# EAGLE design fakealarm (EAGLE 7.1.0)
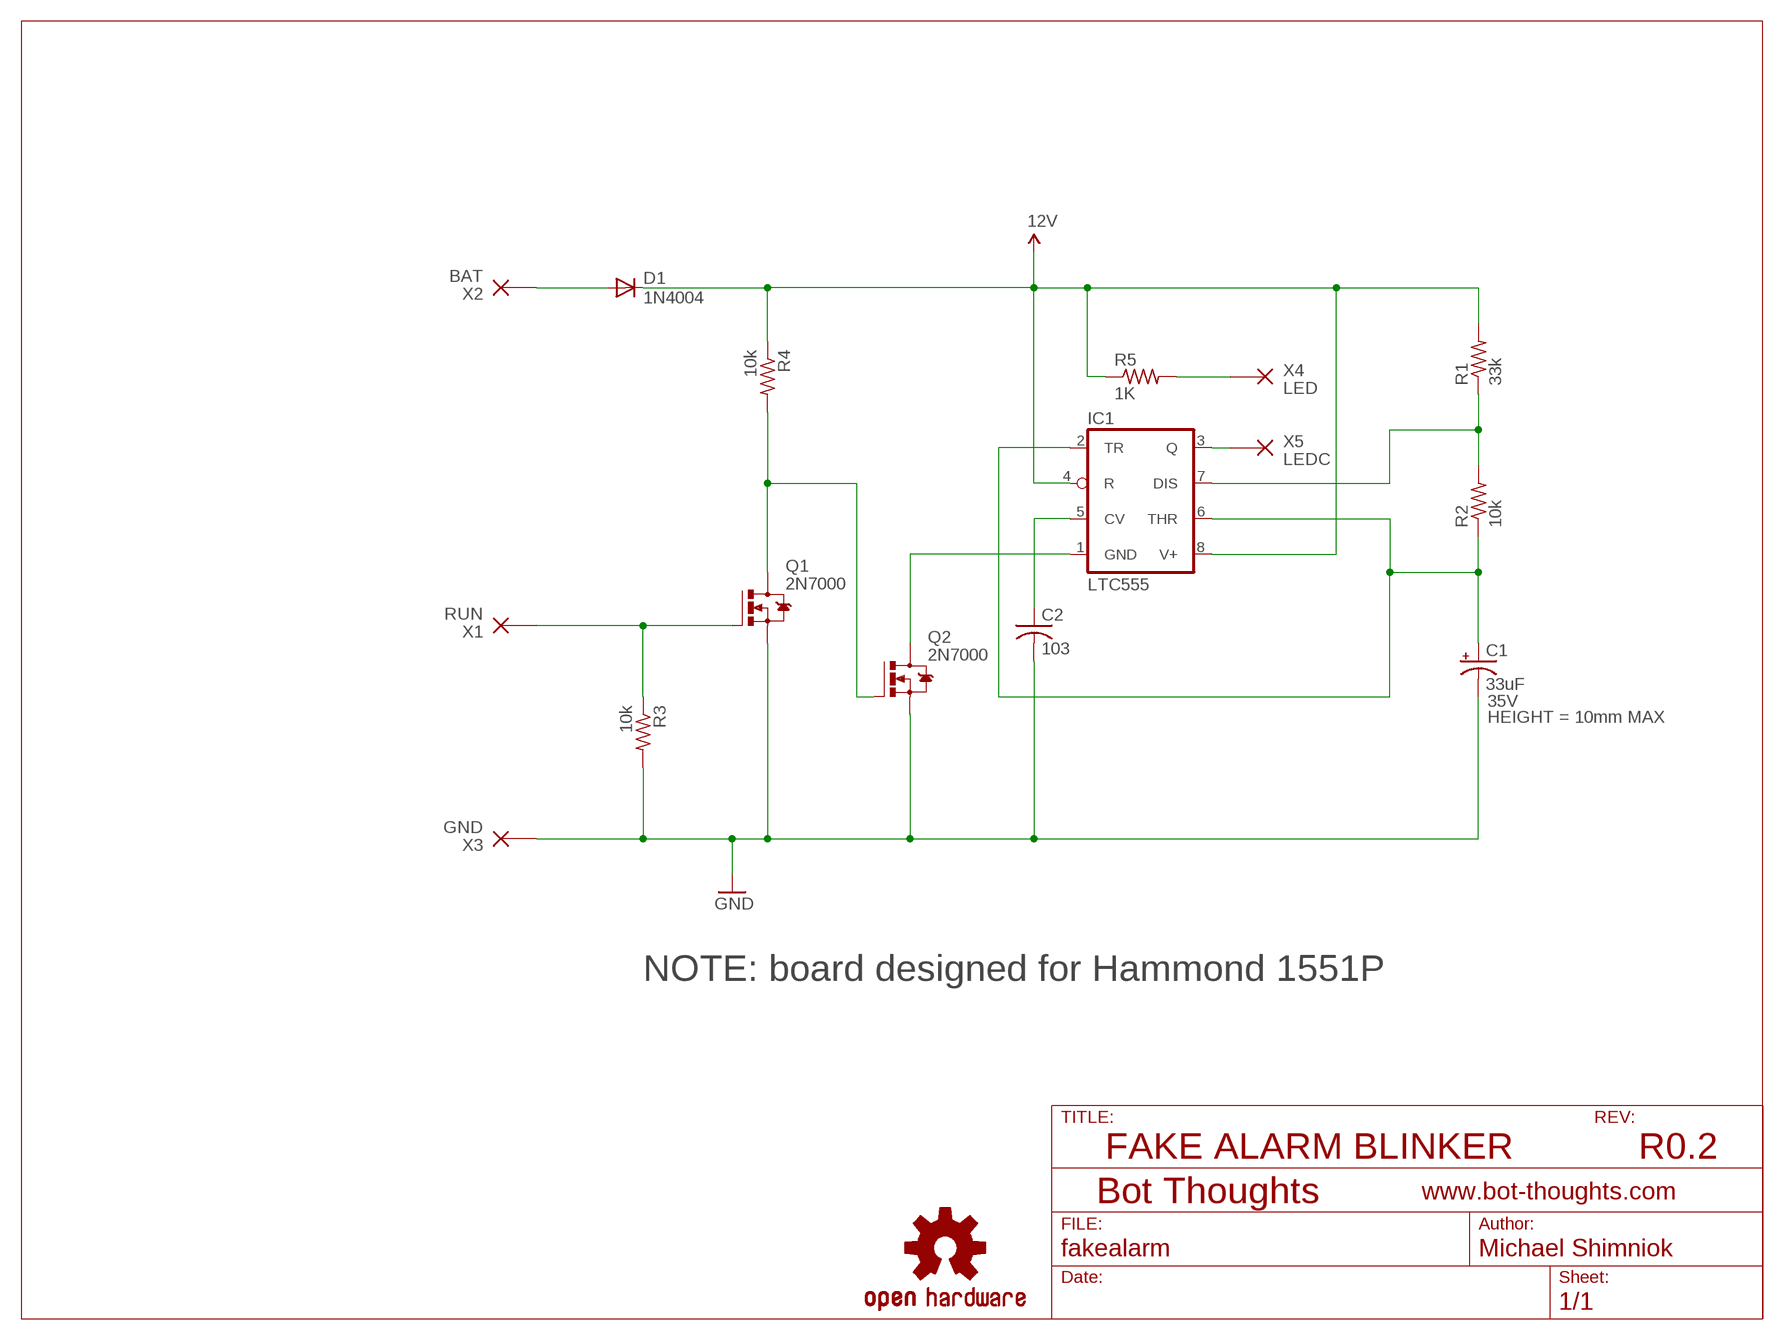
[diagram p0: schematic, sheet 1]

## Parts
C1  33uF  CPOL-USE2.5-6  [E2,5-6]
C2  103  C-US050-024X044  [C050-024X044]
D1  1N4004  [DO41-10]
IC1  LTC555  NE555N  [DIL08]
LOGO1  OSHW-LOGOM  [OSHW-LOGO-M]
Q1  2N7000  MOSFET-NTO92  [TO92D-]
Q2  2N7000  MOSFET-NTO92  [TO92D-]
R1  33k  R-US_0207/10  [0207/10]
R2  10k  R-US_0207/10  [0207/10]
R3  10k  R-US_0207/10  [0207/10]
R4  10k  R-US_0207/10  [0207/10]
R5  1K  R-US_0207/10  [0207/10]
X1  RUN  WIREPAD_14GA  [PAD_14GA]
X2  BAT  WIREPAD_14GA  [PAD_14GA]
X3  GND  WIREPAD_14GA  [PAD_14GA]
X4  LED  WIREPAD_24GA  [PAD_24GA]
X5  LEDC  WIREPAD_24GA  [PAD_24GA]

## Nets
12V: D1.C IC1.4(R) IC1.8(V+) R1.2 R4.1 R5.1
GND: C1.- C2.2 Q1.1(S) Q2.1(S) R3.2 X3.P$1(P)
N$1: Q1.3(D) Q2.2(G) R4.2
N$2: Q1.2(G) R3.1 X1.P$1(P)
N$3: IC1.7(DIS) R1.1 R2.2
N$4: C1.+ IC1.2(TR) IC1.6(THR) R2.1
N$5: IC1.1(GND) Q2.3(D)
N$6: D1.A X2.P$1(P)
N$7: C2.1 IC1.5(CV)
N$9: R5.2 X4.P$1(P)
N$10: IC1.3(Q) X5.P$1(P)

## Notes on the sheet
- NOTE: board designed for Hammond 1551P
- FAKE ALARM BLINKER | R0.2

## Library data of the parts
C1 = rcl:CPOL-US: POLARIZED CAPACITOR, American symbol; HEIGHT: 10mm MAX; VOLTAGE: 35V
C2 = rcl:C-US: CAPACITOR, American symbol
D1 = diode:1N4004: DIODE general purpose rectifier, 1 A
IC1 = linear:*555: TIMER
LOGO1 = SparkFun-Aesthetics:OSHW-LOGO: Open Source Hardware Logo This logo indicates the piece of hardware it is found on incorporates a OSHW license and/or adheres to the definition of open source hardware found here: http://freedomdefined.org/OSHW
Q1 Q2 = ads4:MOSFET-N: N-Channel MOSFET
R1-R5 = rcl:R-US_: RESISTOR, American symbol
X1-X5 = bt_electromech:WIREPAD: PIN PAD (PINPAD) Generic pin pad connector

## Board
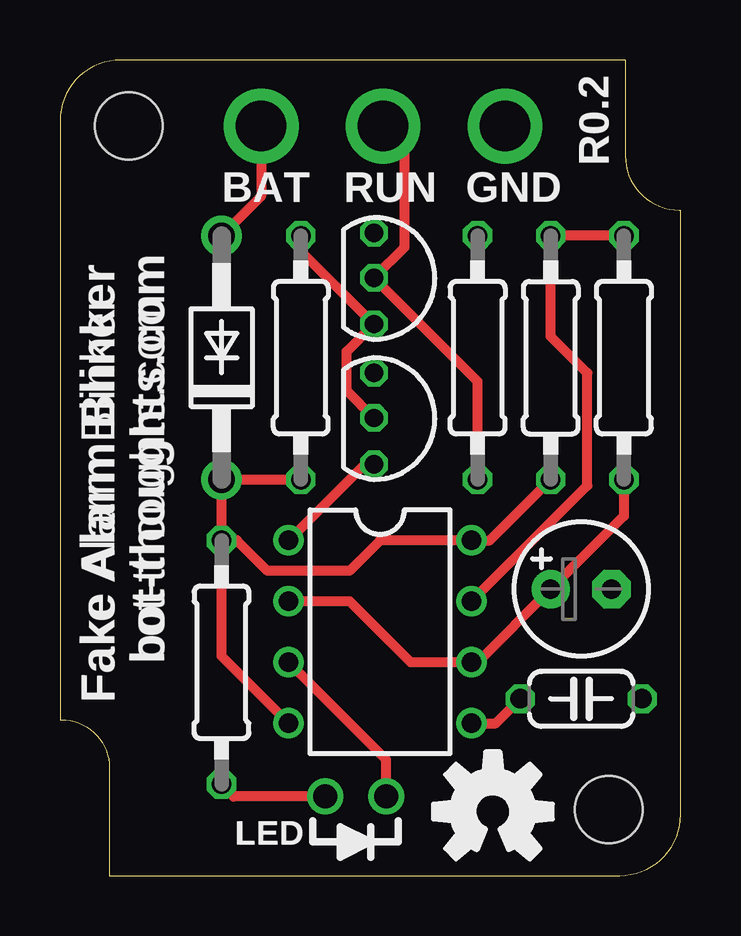
[diagram p1: board, top side]
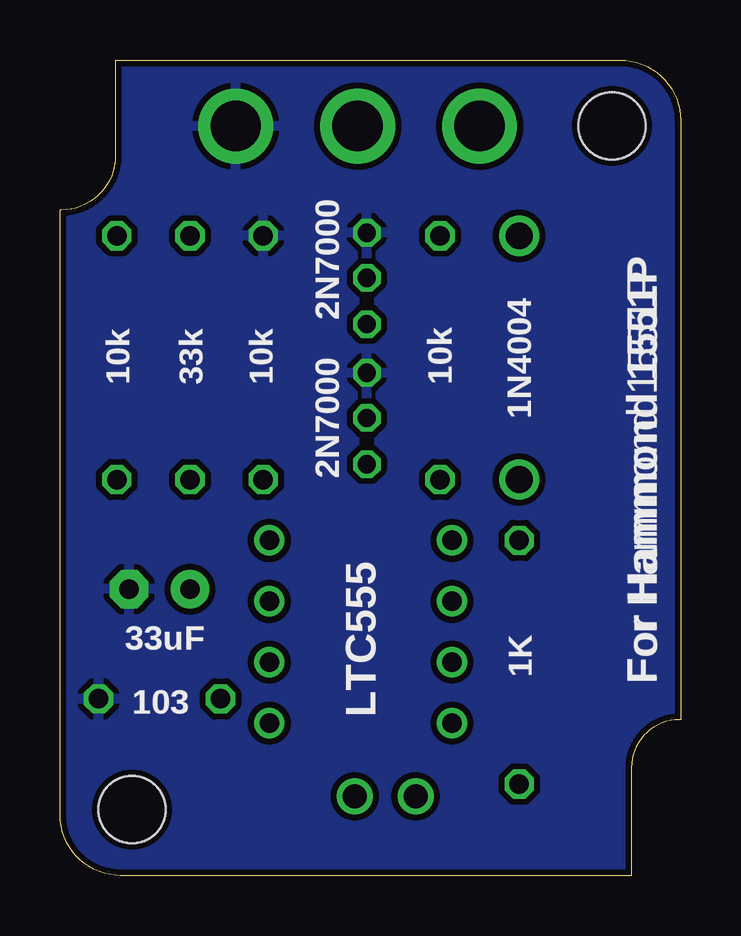
[diagram p2: board, bottom side, seen from below]

Size 25.86 x 34 mm. Coordinates in mm from the lower left corner, seen from the top.
Outline: 0,6.5 0.06,6.5 arc-90 2.06,4.5 2.06,0 23.32,0 arc90 25.86,2.54 25.86,27.75 25.81,27.75 arc-90 23.55,30 23.55,34 2.54,34 arc90 0,31.46 0,6.5
Copper layers (1*16): Top 0.0356mm / dielectric 1.5011mm / Bottom 0.0356mm
Design rules "LaenPCBOrder": minimum track width 6mil, minimum drill 13mil, track to track 10mil, track to pad 10mil, pad to pad 10mil, via to via 10mil, smd to smd 8mil, copper to edge 10mil, drill to drill 10mil, minimum pad ring 7mil, minimum via ring 7mil, stop-mask expansion 3mil, vias tented up to drill 20mil, thermal gap 10mil
Holes 2.8 mm at 2.87,31.25 22.86,2.75

### Footprints (pad centres in the part's own frame; a part is rotated, then mirrored left to right if it is on the bottom)
E2,5-6 = drill 0.813 pad 1.6: + -1.27,0 | drill 0.813 pad 1.6 octagon: - 1.27,0
C050-024X044 = drill 0.813 octagon: 1 -2.54,0; 2 2.54,0
DO41-10 = drill 1.118: A 5.08,0; C -5.08,0
DIL08 = drill 0.813 pad 1.27: 1 -3.81,-3.81; 2 -1.27,-3.81; 3 1.27,-3.81; 4 3.81,-3.81; 5 3.81,3.81; 6 1.27,3.81; 7 -1.27,3.81; 8 -3.81,3.81
TO92D- = drill 0.762 octagon: 1 -1.905,0; 2 -0.025,0; 3 1.905,0
0207/10 = drill 0.813 octagon: 1 -5.08,0; 2 5.08,0
PAD_14GA = drill 2.1: P$1 0,0
PAD_24GA = drill 1: P$1 0,0

### Placement (x,y rotation side)
C1  21.72,11.94 0 top
C2  21.72,7.37 0 top
D1  6.73,21.59 90 top
IC1  13.34,10.16 270 top
LOGO1  18.03,2.67 0 top
Q1  13.08,24.89 270 top
Q2  13.08,19.05 270 top
R1  20.45,21.59 270 top
R2  23.5,21.59 90 top
R3  17.4,21.59 90 top
R4  10.03,21.59 90 top
R5  6.73,8.89 270 top
X1  13.46,31.24 270 top
X2  8.38,31.24 270 top
X3  18.54,31.24 270 top
X4  11.05,3.3 180 top
X5  13.59,3.3 0 top

### Tracks (layer width: path | path; a pad name or v marks a point on that pad's centre or on a via)
12V
  Top 0.406: R1.2 17.91,13.97 IC1.8 13.34,13.97 12.06,12.7 8.64,12.7 7.37,13.97 R5.1 | IC1.4 6.73,9.14 R5.1 | R5.1 D1.C R4.1
GND
  pour Bottom: 0,0 0,31.46 arc-90 2.54,34 25.86,34 25.86,2.54 arc-90 23.32,0
N$1
  Top 0.406: Q2.2 11.94,20.22 11.94,21.84 Q1.3 10.03,26.04 R4.2
N$2
  Top 0.406: X1.P$1 14.35,30.35 14.35,26.19 Q1.2 17.4,20.6 R3.1
N$3
  Top 0.406: IC1.7 21.97,16.26 21.97,20.95 20.45,22.48 R1.1 R2.2
N$4
  Top 0.406: R2.1 23.5,14.99 C1.+ 17.4,8.89 IC1.6 14.61,8.89 12.06,11.43 IC1.2
N$5
  Top 0.406: IC1.1 12.57,17.02 Q2.3
N$6
  Top 0.406: X2.P$1 8.38,28.32 D1.A
N$7
  Top 0.406: IC1.5 18.16,6.35 C2.1
N$9
  Top 0.406: X4.P$1 7.24,3.3 R5.2
N$10
  Top 0.406: X5.P$1 13.59,4.83 IC1.3

### Text on the board
tNames: R0.2 | bot-thoughts.com | Fake Alarm Blinker
bNames: For Hammond 1551P
Document: For Hammond 1551P | Height | 16.0mm inner height | 4.0mm PCB boss | 1.6mm PCB thickness | 10.4mm component height, max
tsilk: R0.2 | BAT | RUN | GND | bot-thoughts.com | Fake Alarm Blinker | LED
bsilk: 2N7000 | 2N7000 | 10k | 10k | 33k | 10k | 1N4004 | 33uF | For Hammond 1551P | 1K | LTC555 | 103